# Altium project MaxVoltstapenV3_PCB.PrjPcb
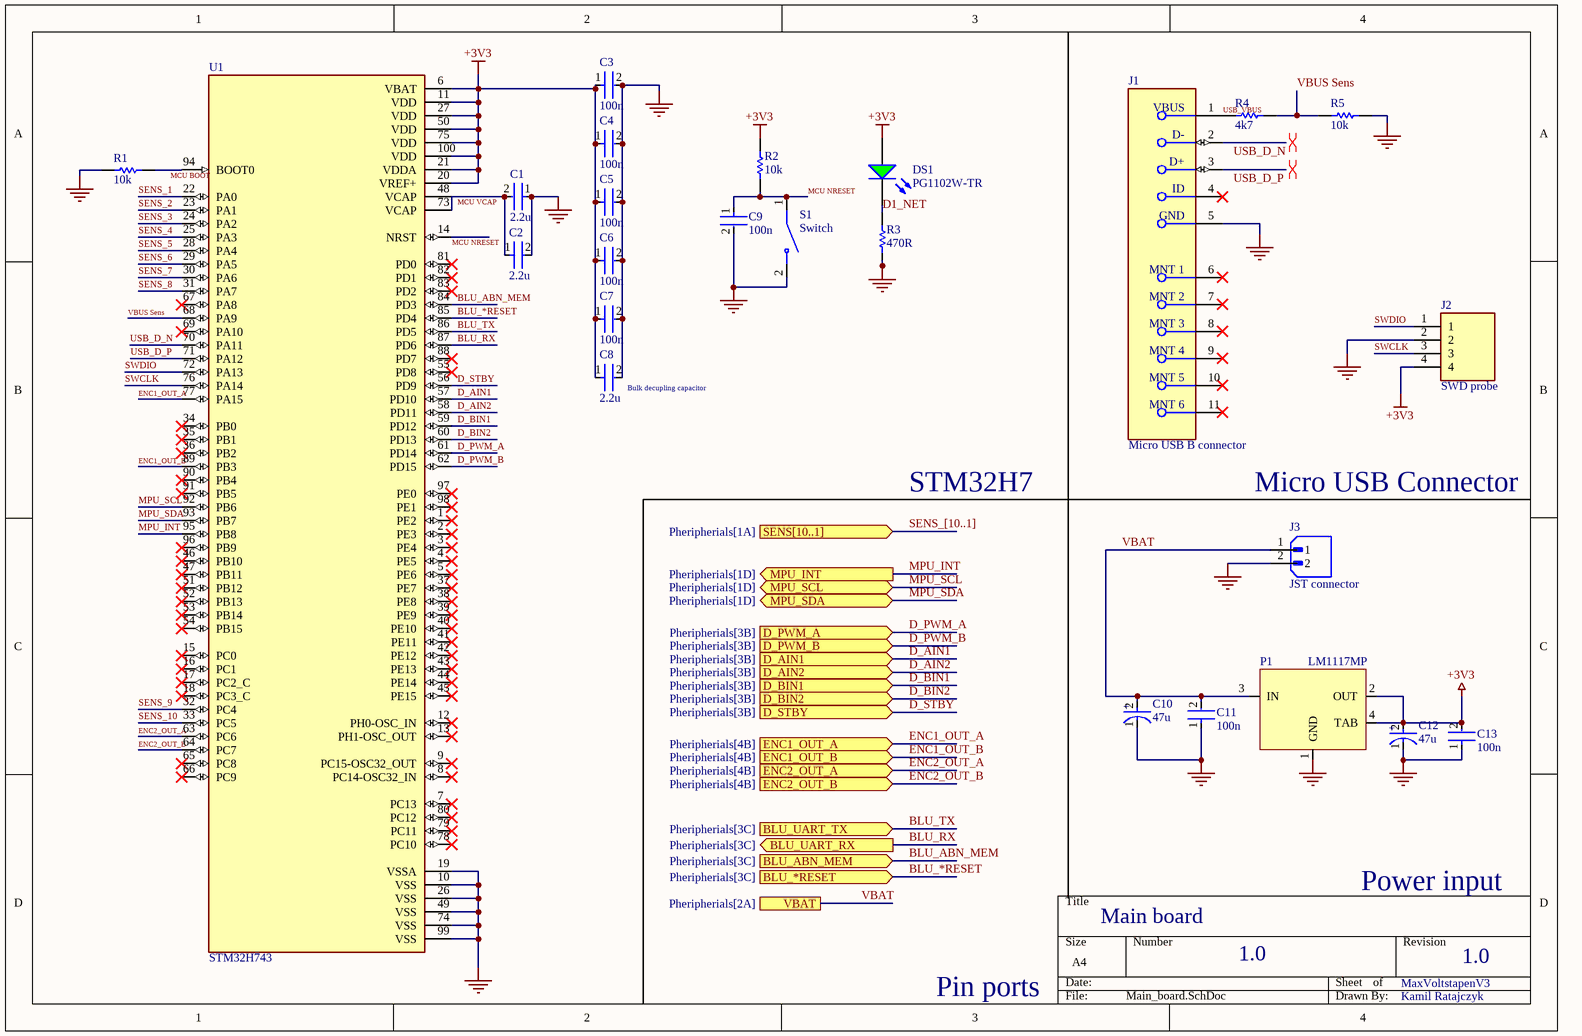
[diagram p0: Main_board.SchDoc]
2 sheets, 40 parts. Net scope: flat (ports and power ports of the same name join across sheets).
Board file: PCB1.PcbDoc
Sheets:
  Main_board.SchDoc
  Pheripherials.SchDoc

## Sheet Main_board.SchDoc
size A4; SheetNumber: 1; SheetTotal: 2

### Parts
C1  2.2u  [FP-CC0805-0_85-MFG]
C2  2.2u  [FP-CC0805-0_85-MFG]
C3  100n  [FP-CC0805-0_85-MFG]
C4  100n  [FP-CC0805-0_85-MFG]
C5  100n  [FP-CC0805-0_85-MFG]
C6  100n  [FP-CC0805-0_85-MFG]
C7  100n  [FP-CC0805-0_85-MFG]
C8  2.2u  [FP-CC0805-0_85-MFG]
C9  100n  [FP-CC0805-0_85-MFG]
C10  47u  [FP-FPD-MFG]
C11  100n  [FP-CC0805-0_85-MFG]
C12  47u  [FP-FPD-MFG]
C13  100n  [FP-CC0805-0_85-MFG]
DS1  PG1102W-TR  [STEC-1102W_V]
J1  Micro USB B connector  [FP-473460001-MFG]
J2  SWD probe  [TE_1987374-4]
J3  JST connector  [JST_B2B-XH-A(LF)(SN)]
P1  LM1117MP  [SOT230P700X180-4N]
R1  10k  [RESC2013X60X35NL10T20]
R2  10k  [RESC2013X60X35NL10T20]
R3  470R  [RESC2013X60X35NL10T20]
R4  4k7  [RESC2013X60X35NL10T20]
R5  10k  [RESC2013X60X35NL10T20]
S1  Switch  [SW_TS-1088-AR02016]
U1  STM32H743  [STM32H743]

### Ports
BLU_*RESET (in, see Pheripherials[3C]), BLU_ABN_MEM (in, see Pheripherials[3C]), BLU_UART_RX (out, see Pheripherials[3C]), BLU_UART_TX (in, see Pheripherials[3C]), D_AIN1 (in, see Pheripherials[3B]), D_AIN2 (in, see Pheripherials[3B]), D_BIN1 (in, see Pheripherials[3B]), D_BIN2 (in, see Pheripherials[3B]), D_PWM_A (in, see Pheripherials[3B]), D_PWM_B (in, see Pheripherials[3B]), D_STBY (in, see Pheripherials[3B]), ENC1_OUT_A (in, see Pheripherials[4B]), ENC1_OUT_B (in, see Pheripherials[4B]), ENC2_OUT_A (in, see Pheripherials[4B]), ENC2_OUT_B (in, see Pheripherials[4B]), MPU_INT (out, see Pheripherials[1D]), MPU_SCL (bidir, see Pheripherials[1D]), MPU_SDA (bidir, see Pheripherials[1D]), SENS[10..1] (in, see Pheripherials[1A]), VBAT (see Pheripherials[2A])

### Nets
+3V3: C3.1 C4.1 C5.1 C6.1 C7.1 C8.1 C12.2(A) C13.2 DS1.1(A) J2.4 P1.2(OUT) P1.4(TAB) R2.1 U1.6(VBAT) U1.11(VDD) U1.20(VREF+) U1.21(VDDA) U1.27(VDD) U1.50(VDD) U1.75(VDD) U1.100(VDD)
GND: C1.1 C2.2 C3.2 C4.2 C5.2 C6.2 C7.2 C8.2 C9.2 C10.1(C) C11.1 C12.1(C) C13.1 J1.5(GND) J2.2 J3.2 P1.1(GND) R1.1 R3.2 R5.2 S1.2 U1.10(VSS) U1.19(VSSA) U1.26(VSS) U1.49(VSS) U1.74(VSS) U1.99(VSS)
BLU_*RESET: U1.85(PD4) ; port BLU_*RESET
BLU_ABN_MEM: U1.84(PD3) ; port BLU_ABN_MEM
BLU_RX: U1.87(PD6) ; port BLU_UART_RX
BLU_TX: U1.86(PD5) ; port BLU_UART_TX
D1_NET: DS1.2(K) R3.1
D_AIN1: U1.57(PD10) ; port D_AIN1  [project net D_A_IN_1]
D_AIN2: U1.58(PD11) ; port D_AIN2  [project net D_A_IN_2]
D_BIN1: U1.59(PD12) ; port D_BIN1  [project net D_B_IN_1]
D_BIN2: U1.60(PD13) ; port D_BIN2  [project net D_B_IN_2]
D_PWM_A: U1.61(PD14) ; port D_PWM_A
D_PWM_B: U1.62(PD15) ; port D_PWM_B
D_STBY: U1.56(PD9) ; port D_STBY
ENC1_OUT_A: U1.77(PA15) ; port ENC1_OUT_A
ENC1_OUT_B: U1.89(PB3) ; port ENC1_OUT_B
ENC2_OUT_A: U1.63(PC6) ; port ENC2_OUT_A
ENC2_OUT_B: U1.64(PC7) ; port ENC2_OUT_B
MCU BOOT: R1.2 U1.94(BOOT0)
MCU NRESET: C9.1 R2.2 S1.1 U1.14(NRST)
MCU VCAP: C1.2 C2.1 U1.48(VCAP) U1.73(VCAP)
MPU_INT: U1.95(PB8) ; port MPU_INT  [project net MPU INT]
MPU_SCL: U1.92(PB6) ; port MPU_SCL  [project net MPU SCL]
MPU_SDA: U1.93(PB7) ; port MPU_SDA  [project net MPU SDA]
SENS_1: U1.22(PA0)  [project net SENS1]
SENS_2: U1.23(PA1)  [project net SENS2]
SENS_3: U1.24(PA2)  [project net SENS3]
SENS_4: U1.25(PA3)  [project net SENS4]
SENS_5: U1.28(PA4)  [project net SENS5]
SENS_6: U1.29(PA5)  [project net SENS6]
SENS_7: U1.30(PA6)  [project net SENS7]
SENS_8: U1.31(PA7)  [project net SENS8]
SENS_9: U1.32(PC4)  [project net SENS9]
SENS_10: U1.33(PC5)  [project net SENS10]
SWCLK: J2.3 U1.76(PA14)
SWDIO: J2.1 U1.72(PA13)
USB_D_N: J1.2(D-) U1.70(PA11)
USB_D_P: J1.3(D+) U1.71(PA12)
USB_VBUS: J1.1(VBUS) R4.1
VBAT: C10.2(A) C11.2 J3.1 P1.3(IN) ; port VBAT
VBUS Sens: R4.2 R5.1 U1.68(PA9)

Not connected (* = marked no-connect by the designer): J1 4(ID)* 6(MNT_1)* 7(MNT_2)* 8(MNT_3)* 9(MNT_4)* 10(MNT_5)* 11(MNT_6)*; U1 1(PE2)* 2(PE3)* 3(PE4)* 4(PE5)* 5(PE6)* 7(PC13)* 8(PC14-OSC32_IN)* 9(PC15-OSC32_OUT)* 12(PH0-OSC_IN)* 13(PH1-OSC_OUT)* 15(PC0)* 16(PC1)* 17(PC2_C)* 18(PC3_C)* 34(PB0)* 35(PB1)* 36(PB2)* 37(PE7)* 38(PE8)* 39(PE9)* 40(PE10)* 41(PE11)* 42(PE12)* 43(PE13)* 44(PE14)* 45(PE15)* 46(PB10)* 47(PB11)* 51(PB12)* 52(PB13)* 53(PB14)* 54(PB15)* 55(PD8)* 65(PC8)* 66(PC9)* 67(PA8)* 69(PA10)* 78(PC10)* 79(PC11)* 80(PC12)* 81(PD0)* 82(PD1)* 83(PD2)* 88(PD7)* 90(PB4)* 91(PB5)* 96(PB9)* 97(PE0)* 98(PE1)*

### Buses and harness runs
bus SENS_[10..1] = port SENS[10..1]

### Layout directives
differential pair; net class DIFF_USB: USB_D_N, USB_D_P

### Notes on the sheet
- (near C8) Bulk decupling capacitor
- STM32H7
- (near J3) Micro USB Connector
- Power input
- Main board
- 1.0
- MaxVoltstapenV3
- Pin ports
- Kamil Ratajczyk
- (in symbol CMP-2000-06216-2) +

### Library data of the parts
C1-C9 C11 C13 = CMP-1036-04402-6: CAP CER 0.1UF 16V X7R 0805; Manufacturer Part Number: CC0805KRX7R7BB104; Manufacturer: Yageo; Material: Ceramic; Tolerance: 0.1; Capacitance: 100 nF; Value: 100 nF; Temperature: -30°C to +85°C; Lead Free: Yes; Footprint Url: http://www.yageo.com/exep/pages/download/literatures/UPY-C_GEN_24.pdf; Voltage Rating: 16 V; Package: CC0805-0.85; RoHS: TRUE; Digikey Description: CAP CER 0.1UF 16V X7R 0805; Category: Cap; Octopart: https://octopart.com/cc0805krx7r7bb104-yageo-39467769; Device Class L3: Ceramic Capacitors; ComponentLink2URL: http://www.yageo.com/documents/recent/UPY-GPHC_Y5V_6.3V-to-50V_8.pdf; Temperature Range Low: -30°C; Mouser Description: Multilayer Ceramic Capacitors MLCC - SMD/SMT 100nF 16V X7R 10%; Automotive: No; Device Class L2: Capacitors; Height: 0.95mm; ComponentLink2Description: Datasheet; Temperature Characteristic: X7R; Ipc Land Pattern Name: CAPC200125X85; Device Class L1: Passive Components; Temperature Range High: +85°C
C10 C12 = CMP-2000-06216-2: CAP ALUM 47UF 20% 35V SMD; Life (Hours): 2000Hour; Leakage Current: 3uA; Dissipation Factor: 0.12%; Material: Aluminium; Ripple Current (AC): 300mA; ESR (Equivalent Series Resistance): 260mR; Construction: Cylindrical; Contact Plating: Tin; Termination: SMD/SMT; RoHS Compliant: Yes; Voltage Rating (DC): 35V; Package Quantity: 1; Tolerance: 20%; Mount: Surface Mount; Diameter: 6.3mm; Lead Free: Lead Free; Number of Pins: 2; Radiation Hardening: No; Series: FP; REACH SVHC: No SVHC; Length: 5.8mm; Height - Seated (Max): 0.228inch; Capacitance: 47uF; Packaging: Tape and Reel; Voltage Rating: 35V; Min Operating Temperature: -55°C; Voltage: 35V; Case/Package: Radial; Max Operating Temperature: 105°C; Ripple Current: 300mA; Height: 5.8mm; Lead Pitch: 1.8mm
DS1 = CMP-2000-06890-1: Green LED, 567 nm, 2.1 V, 30 mA, -30 to 85 degC, 2-Pin SMD, RoHS, Tape and Reel; Manufacturer: Stanley Electric; Viewing Angle: 69/85deg; High Brightness: No; Number of  Elements: 1; Peak Wavelength: 560nm; Forward Current: 30mA; Test Current (It): 20mA; Main Category: ChipLED; Type: Uni-Color; Dominant Wave Length: 567nm; Power Dissipation: 75W; Lum Intensity: 12mcd; Shape Type: Rectangular; Chip Material: GaP; Reverse Voltage: 4V; Product Depth (mm): 1.5mm; Forward Voltage: 2.5V; Product Length (mm): 3mm; DELETED: Compliant; Emitting Color: YellowGreen; Operating Temp Range: -30Cto85C; Datasheet URL: http://media.digikey.com/pdf/Data%20Sheets/Stanley%20Electric%20PDFs/1102W_Series.pdf; Packaging: TapeandReel; Package Reference: 1102W; Manufacturer URL: http://www.stanley-electric.com/; Package Description: 2-Pin Surface Mounted Device , Body 3 x 1.5 mm; Rad Hardened: No; Mounting Technology: SurfaceMount; Package Type: SMD; Operating Temperature Classification: Commercial; Product Height (mm): 1.5mm; Pin Count: 2; Lens Dimensions: 2x1.5x0.9mm; Datasheet Version: 08/2007; Mounting: SurfaceMount; Luminous Intensity: 12mcd
J1 = CMP-2000-05246-2: CONN RCPT USB2.0 MICRO B SMD R/A; Manufacturer: Molex; Manufacturer Part Number: 473460001; Conn Orientation: Right Angle; Is Female: yes; Shielding: true; Pitch: 0.65mm; Number Of Contacts: 5; Voltage Rating: 30V; Current Rating: 1.8A; Device Class L2: USB Connectors; Digikey Description: CONN RCPT USB2.0 MICRO B SMD R/A; Height: 2.945mm; RoHS: TRUE; ComponentLink2Description: Datasheet; Octopart: https://octopart.com/47346-0001-molex-7164928; Automotive: No; Package: 0; Category: Conn; Device Class L1: Connectors; Usb Standard: USB 2.0; Temperature: -30°C to +85°C; Temperature Range Low: -30°C; Footprint Url: https://www.molex.com/pdm_docs/sd/473460001_sd.pdf; ComponentLink2URL: https://www.molex.com/webdocs/datasheets/pdf/en-us/0473460001_IO_CONNECTORS.pdf; Lead Free: Yes; Contact Material: Gold,Nickel; Temperature Range High: +85°C; Device Class L3: unset
J2 = 1987374-4: Pin Connector AMPMODU II PIN HEADER SINGLE ROW 4 POS; MF: TE Connectivity; Price: None; Availability: Unavailable; Package: None; MP: 1987374-4; TE_purchase_URL: https://www.te.com/usa-en/product-1987374-4.html?te_bu=Cor&te_type=disp&te_campaign=seda_glo_cor-seda-global-disp-prtnr-fy19-seda-model-bom-cta_sma-317_1&elqCampaignId=32493; Value: *; SnapEDA_Link: https://www.snapeda.com/parts/1987374-4/TE%20Connectivity/view-part/3100872/?ref=snap
J3 = B2B-XH-A(LF)(SN): Connector Header Through Hole 2 position 0.098 (2.50mm); MF: JST Sales America Inc.; SnapEDA_Link: https://www.snapeda.com/parts/B2B-XH-A(LF)(SN)/JST+Sales+America+Inc./view-part/?ref=snap; Package: None; Value: *; MP: B2B-XH-A(LF)(SN); Check_prices: https://www.snapeda.com/parts/B2B-XH-A(LF)(SN)/JST+Sales+America+Inc./view-part/?ref=eda
R1-R5 = CMP-1659-00013-4: Chip Resistor, 10 KOhm, +/- 1%, 0.125 W, -55 to 155 degC, 0805 (2012 Metric), RoHS, Tape and Reel; Manufacturer: Yageo; Voltage Rating: 150 V; Mount: Surface Mount; ComponentLink1Description: Manufacturer URL; ComponentLink2URL: http://www.yageo.com/documents/recent/PYu-RC_Group_51_RoHS_L_04.pdf; Pins: 2; Length: 2 mm; Min Operating Temperature: -55 degC; Height: 0.5 mm; Mounting Technology: Surface Mount; RoHSCompliant: true; REACH SVHC: No SVHC; ComponentLink1URL: http://www.yageo.com/; Max Operating Temperature: 155 degC; PackageReference: 0805; DatasheetVersion: Rev. 4, 02/2016; Package Quantity: 5000; Packaging: Tape and Reel; ComponentLink2Description: Datasheet; PackageDescription: 2-Pin Surface Mounted Device, Body 2 x 1.25 mm
S1 = TS-1088-AR02016: 50mA 4mm 100MÎ© 100,000 Times 12V 160gf 3mm 2mm Round Button Vertical welding SPST SMD Tactile Switches ROHS; MF: Xunpu; SnapEDA_Link: https://www.snapeda.com/parts/TS-1088-AR02016/Xunpu/view-part/?ref=snap; Package: Package; Value: *; MP: TS-1088-AR02016; Check_prices: https://www.snapeda.com/parts/TS-1088-AR02016/Xunpu/view-part/?ref=eda
U1 = STM32H743: ARMÂ® CortexÂ®-M7 STM32H7 Microcontroller IC 32-Bit 480MHz 2MB (2M x 8) FLASH 100-LQFP (14x14); MP: STM32H743VIT6; Package: None; Availability: Unavailable; Value: *; Price: None

## Sheet Pheripherials.SchDoc
size A4; SheetNumber: 2; SheetTotal: 2
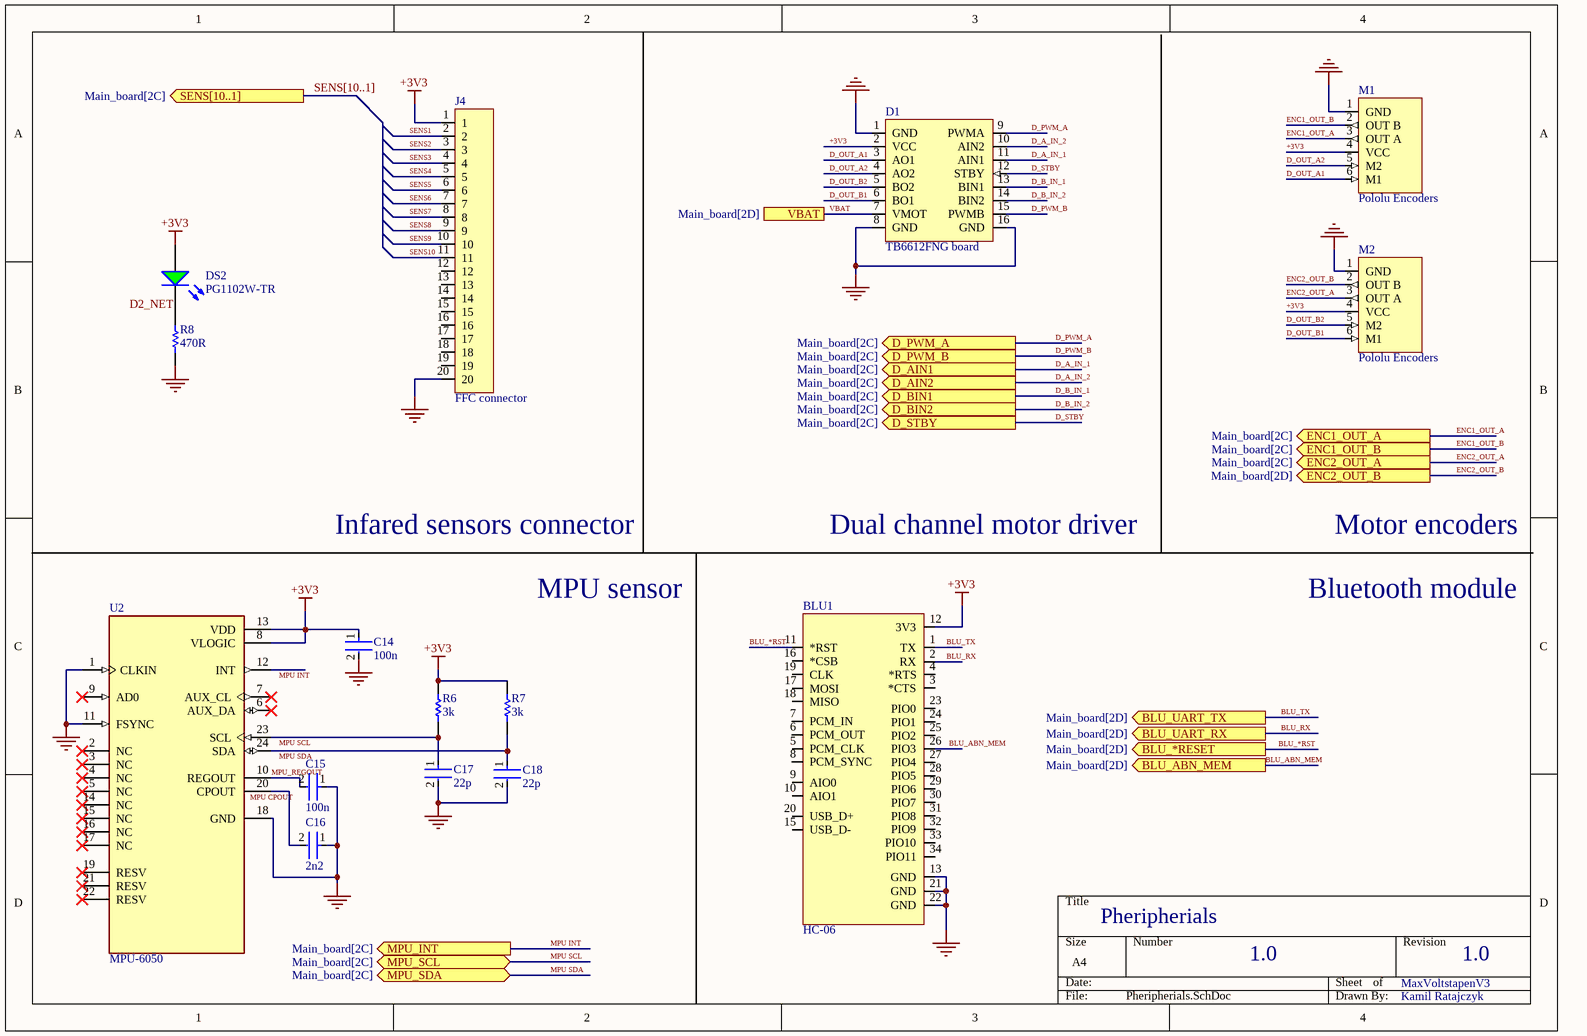
[diagram p1: Pheripherials.SchDoc]

### Parts
BLU1  HC-06
C14  100n  [FP-CC0805-0_85-MFG]
C15  100n  [FP-CC0805-0_85-MFG]
C16  2n2  [FP-CC0805-0_85-MFG]
C17  22p  [FP-CC0805-0_85-MFG]
C18  22p  [FP-CC0805-0_85-MFG]
D1  TB6612FNG board  [TB6612FNG board footprint]
DS2  PG1102W-TR  [STEC-1102W_V]
J4  FFC connector  [GCT_FFC2B35-20-G_REVA2]
M1  Pololu Encoders  [Encoders Pololu footprint]
M2  Pololu Encoders  [Encoders Pololu footprint]
R6  3k  [RESC2013X60X35NL10T20]
R7  3k  [RESC2013X60X35NL10T20]
R8  470R  [RESC2013X60X35NL10T20]
U2  MPU-6050  [QFN50P400X400X95-24N]

### Ports
BLU_*RESET (out, see Main_board[2D]), BLU_ABN_MEM (out, see Main_board[2D]), BLU_UART_RX (out, see Main_board[2D]), BLU_UART_TX (out, see Main_board[2D]), D_AIN1 (out, see Main_board[2C]), D_AIN2 (out, see Main_board[2C]), D_BIN1 (out, see Main_board[2C]), D_BIN2 (out, see Main_board[2C]), D_PWM_A (out, see Main_board[2C]), D_PWM_B (out, see Main_board[2C]), D_STBY (out, see Main_board[2C]), ENC1_OUT_A (out, see Main_board[2C]), ENC1_OUT_B (out, see Main_board[2C]), ENC2_OUT_A (out, see Main_board[2C]), ENC2_OUT_B (out, see Main_board[2D]), MPU_INT (out, see Main_board[2C]), MPU_SCL (bidir, see Main_board[2C]), MPU_SDA (bidir, see Main_board[2C]), SENS[10..1] (out, see Main_board[2C]), VBAT (see Main_board[2D])

### Nets
+3V3: BLU1.12(3V3) C14.1 D1.2(VCC) DS2.1(A) J4.1 M1.4(VCC) M2.4(VCC) R6.1 R7.1 U2.8(VLOGIC) U2.13(VDD)
GND: BLU1.13(GND) BLU1.21(GND) BLU1.22(GND) C14.2 C15.1 C16.1 C17.2 C18.2 D1.1(GND) D1.8(GND) D1.16(GND) J4.20 M1.1(GND) M2.1(GND) R8.2 U2.1(CLKIN) U2.11(FSYNC) U2.18(GND)
BLU_*RST: BLU1.11(*RST) ; port BLU_*RESET  [project net BLU_*RESET]
BLU_ABN_MEM: BLU1.26(PIO3) ; port BLU_ABN_MEM
BLU_RX: BLU1.2(RX) ; port BLU_UART_RX
BLU_TX: BLU1.1(TX) ; port BLU_UART_TX
D2_NET: DS2.2(K) R8.1
D_A_IN_1: D1.11(AIN1) ; port D_AIN1
D_A_IN_2: D1.10(AIN2) ; port D_AIN2
D_B_IN_1: D1.13(BIN1) ; port D_BIN1
D_B_IN_2: D1.14(BIN2) ; port D_BIN2
D_OUT_A1: D1.3(AO1) M1.6(M1)
D_OUT_A2: D1.4(AO2) M1.5(M2)
D_OUT_B1: D1.6(BO1) M2.6(M1)
D_OUT_B2: D1.5(BO2) M2.5(M2)
D_PWM_A: D1.9(PWMA) ; port D_PWM_A
D_PWM_B: D1.15(PWMB) ; port D_PWM_B
D_STBY: D1.12(STBY) ; port D_STBY
ENC1_OUT_A: M1.3(OUT_A) ; port ENC1_OUT_A
ENC1_OUT_B: M1.2(OUT_B) ; port ENC1_OUT_B
ENC2_OUT_A: M2.3(OUT_A) ; port ENC2_OUT_A
ENC2_OUT_B: M2.2(OUT_B) ; port ENC2_OUT_B
MPU INT: U2.12(INT) ; port MPU_INT
MPU SCL: C17.1 R6.2 U2.23(SCL) ; port MPU_SCL
MPU SDA: C18.1 R7.2 U2.24(SDA) ; port MPU_SDA
MPU_REGOUT: C15.2 U2.10(REGOUT)
SENS1: J4.2
SENS2: J4.3
SENS3: J4.4
SENS4: J4.5
SENS5: J4.6
SENS6: J4.7
SENS7: J4.8
SENS8: J4.9
SENS9: J4.10
SENS10: J4.11
VBAT: D1.7(VMOT) ; port VBAT
NetC16_2: C16.2 U2.20(CPOUT)

Not connected (* = marked no-connect by the designer): BLU1 3(*CTS) 4(*RTS) 5(PCM_CLK) 6(PCM_OUT) 7(PCM_IN) 8(PCM_SYNC) 9(AIO0) 10(AIO1) 15(USB_D-) 16(*CSB) 17(MOSI) 18(MISO) 19(CLK) 20(USB_D+) 23(PIO0) 24(PIO1) 25(PIO2) 27(PIO4) 28(PIO5) 29(PIO6) 30(PIO7) 31(PIO8) 32(PIO9) 33(PIO10) 34(PIO11); J4 12 13 14 15 16 17 18 19; U2 2(NC)* 3(NC)* 4(NC)* 5(NC)* 6(AUX_DA)* 7(AUX_CL)* 9(AD0)* 14(NC)* 15(NC)* 16(NC)* 17(NC)* 19(RESV)* 21(RESV)* 22(RESV)*

### Buses and harness runs
bus SENS[10..1] = port SENS[10..1]

### Notes on the sheet
- Infared sensors connector
- Dual channel motor driver
- Motor encoders
- MPU sensor
- Bluetooth module
- Pheripherials
- 1.0
- MaxVoltstapenV3
- Kamil Ratajczyk
- Labels drawn without touching a wire or pin: MPU CPOUT

### Library data of the parts
BLU1 = BLUETOOTH-SERIAL-HC-06
C14-C18 = CMP-1036-04402-6: as C1 on sheet Main_board; Temperature: -30°C to +85°C; Lead Free: Yes; Footprint Url: http://www.yageo.com/exep/pages/download/literatures/UPY-C_GEN_24.pdf; Voltage Rating: 16 V; Package: CC0805-0.85; RoHS: TRUE; Digikey Description: CAP CER 0.1UF 16V X7R 0805; Category: Cap; Octopart: https://octopart.com/cc0805krx7r7bb104-yageo-39467769; Device Class L3: Ceramic Capacitors; ComponentLink2URL: http://www.yageo.com/documents/recent/UPY-GPHC_Y5V_6.3V-to-50V_8.pdf; Temperature Range Low: -30°C; Mouser Description: Multilayer Ceramic Capacitors MLCC - SMD/SMT 100nF 16V X7R 10%; Automotive: No; Device Class L2: Capacitors; Height: 0.95mm; ComponentLink2Description: Datasheet; Temperature Characteristic: X7R; Ipc Land Pattern Name: CAPC200125X85; Device Class L1: Passive Components; Temperature Range High: +85°C
DS2 = CMP-2000-06890-1: as DS1 on sheet Main_board; Operating Temp Range: -30Cto85C; Datasheet URL: http://media.digikey.com/pdf/Data%20Sheets/Stanley%20Electric%20PDFs/1102W_Series.pdf; Packaging: TapeandReel; Package Reference: 1102W; Manufacturer URL: http://www.stanley-electric.com/; Package Description: 2-Pin Surface Mounted Device , Body 3 x 1.5 mm; Rad Hardened: No; Mounting Technology: SurfaceMount; Package Type: SMD; Operating Temperature Classification: Commercial; Product Height (mm): 1.5mm; Pin Count: 2; Lens Dimensions: 2x1.5x0.9mm; Datasheet Version: 08/2007; Mounting: SurfaceMount; Luminous Intensity: 12mcd
J4 = FFC2B35-20-G
R6-R8 = CMP-1659-00013-4: as R1 on sheet Main_board; Mount: Surface Mount; ComponentLink1Description: Manufacturer URL; ComponentLink2URL: http://www.yageo.com/documents/recent/PYu-RC_Group_51_RoHS_L_04.pdf; Pins: 2; Length: 2 mm; Min Operating Temperature: -55 degC; Height: 0.5 mm; Mounting Technology: Surface Mount; RoHSCompliant: true; REACH SVHC: No SVHC; ComponentLink1URL: http://www.yageo.com/; Max Operating Temperature: 155 degC; PackageReference: 0805; DatasheetVersion: Rev. 4, 02/2016; Package Quantity: 5000; Packaging: Tape and Reel; ComponentLink2Description: Datasheet; PackageDescription: 2-Pin Surface Mounted Device, Body 2 x 1.25 mm
U2 = MPU-6050: MPU-6050 series Accelerometer, Gyroscope, 3 Axis Sensor Evaluation Board; MF: TDK InvenSense; SnapEDA_Link: https://www.snapeda.com/parts/MPU-6050/TDK+InvenSense/view-part/?ref=snap; Package: QFN-24 InvenSense; Value: *; MP: MPU-6050; Check_prices: https://www.snapeda.com/parts/MPU-6050/TDK+InvenSense/view-part/?ref=eda

## Nets that join several sheets
+3V3: Main_board (21 pins), Pheripherials (11 pins)
GND: Main_board (27 pins), Pheripherials (18 pins)
BLU_*RESET: Main_board (U1.85), Pheripherials (BLU1.11)
BLU_ABN_MEM: Main_board (U1.84), Pheripherials (BLU1.26)
BLU_RX: Main_board (U1.87), Pheripherials (BLU1.2)
BLU_TX: Main_board (U1.86), Pheripherials (BLU1.1)
D_A_IN_1: Main_board (U1.57), Pheripherials (D1.11)
D_A_IN_2: Main_board (U1.58), Pheripherials (D1.10)
D_B_IN_1: Main_board (U1.59), Pheripherials (D1.13)
D_B_IN_2: Main_board (U1.60), Pheripherials (D1.14)
D_PWM_A: Main_board (U1.61), Pheripherials (D1.9)
D_PWM_B: Main_board (U1.62), Pheripherials (D1.15)
D_STBY: Main_board (U1.56), Pheripherials (D1.12)
ENC1_OUT_A: Main_board (U1.77), Pheripherials (M1.3)
ENC1_OUT_B: Main_board (U1.89), Pheripherials (M1.2)
ENC2_OUT_A: Main_board (U1.63), Pheripherials (M2.3)
ENC2_OUT_B: Main_board (U1.64), Pheripherials (M2.2)
MPU INT: Main_board (U1.95), Pheripherials (U2.12)
MPU SCL: Main_board (U1.92), Pheripherials (C17.1 R6.2 U2.23)
MPU SDA: Main_board (U1.93), Pheripherials (C18.1 R7.2 U2.24)
SENS1: Main_board (U1.22), Pheripherials (J4.2)
SENS2: Main_board (U1.23), Pheripherials (J4.3)
SENS3: Main_board (U1.24), Pheripherials (J4.4)
SENS4: Main_board (U1.25), Pheripherials (J4.5)
SENS5: Main_board (U1.28), Pheripherials (J4.6)
SENS6: Main_board (U1.29), Pheripherials (J4.7)
SENS7: Main_board (U1.30), Pheripherials (J4.8)
SENS8: Main_board (U1.31), Pheripherials (J4.9)
SENS9: Main_board (U1.32), Pheripherials (J4.10)
SENS10: Main_board (U1.33), Pheripherials (J4.11)
VBAT: Main_board (C10.2 C11.2 J3.1 P1.3), Pheripherials (D1.7)